# EAGLE design motherboard (EAGLE 9.5.0)
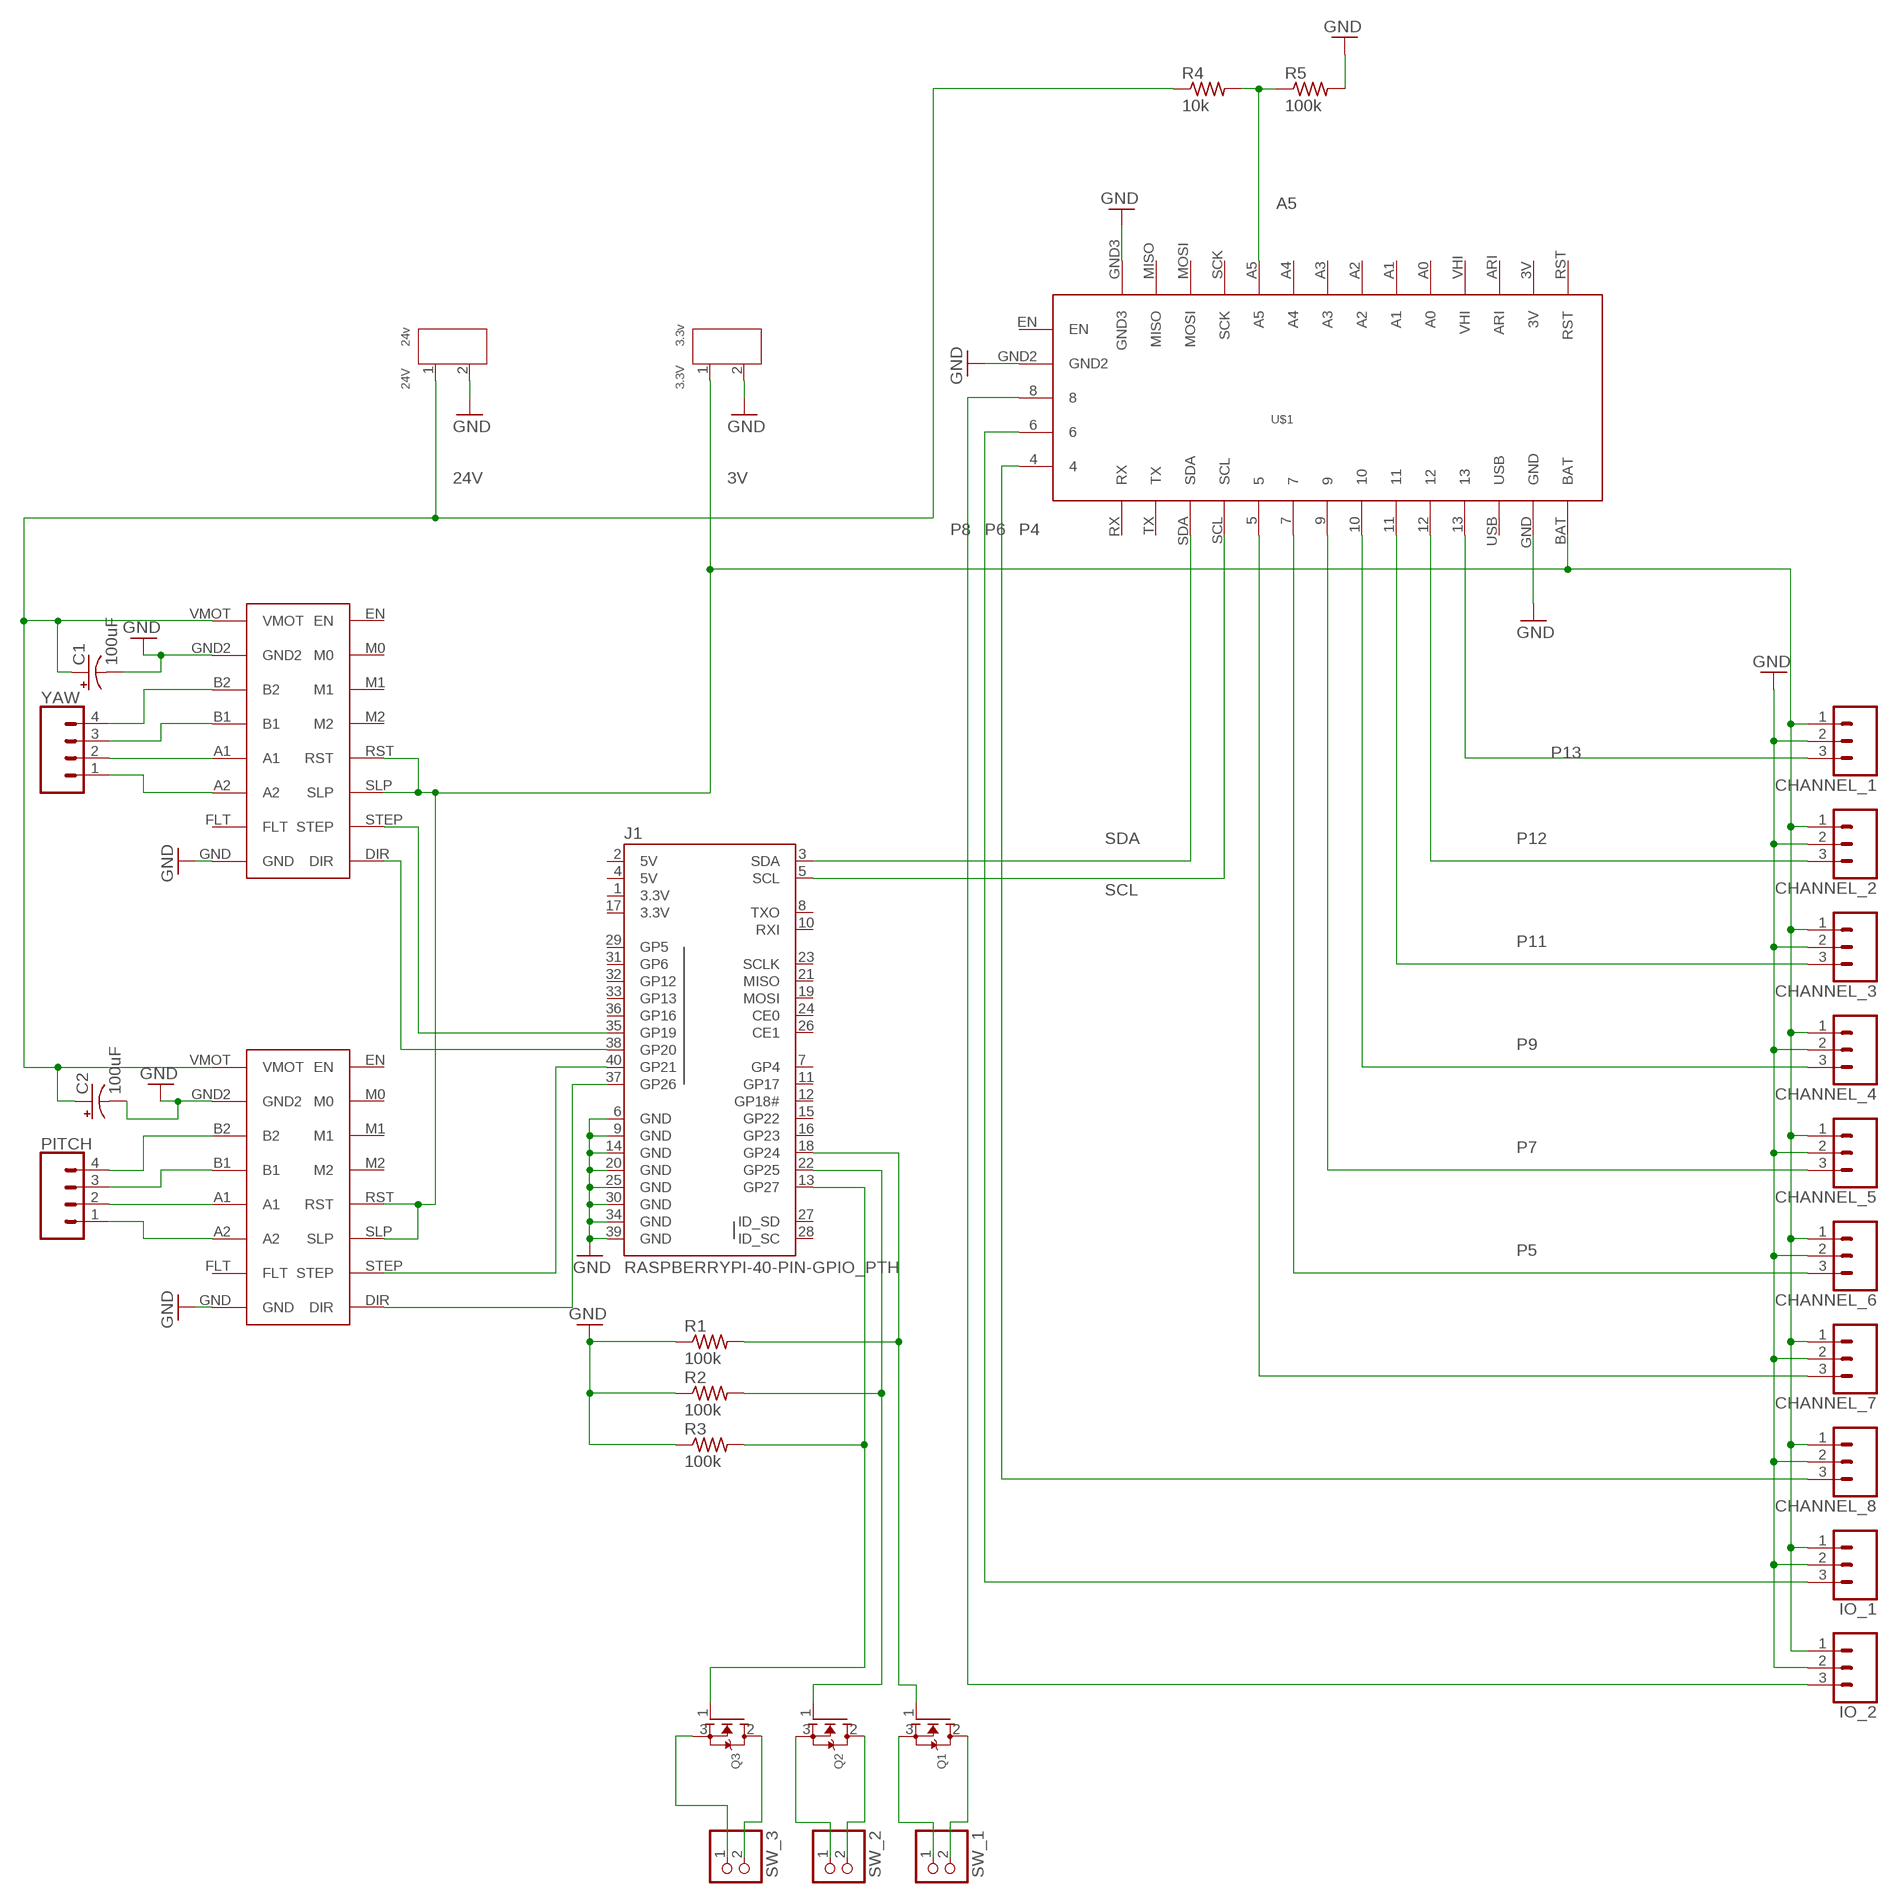
[diagram p0: schematic, sheet 1]

## Parts
3.3V  3.3v  SCREW-TERMINAL-GREEN(2P-5.0)  [H2-5.0-10.5X8.0MM]
24V  24v  SCREW-TERMINAL-GREEN(2P-5.0)  [H2-5.0-10.5X8.0MM]
C1  100uF  1000UF-RADIAL-5MM-25V-20%  [CPOL-RADIAL-5MM-10MM]
C2  100uF  1000UF-RADIAL-5MM-25V-20%  [CPOL-RADIAL-5MM-10MM]
CHANNEL_1  CONN_03JST-PTH  [JST-3-PTH]
CHANNEL_2  CONN_03JST-PTH  [JST-3-PTH]
CHANNEL_3  CONN_03JST-PTH  [JST-3-PTH]
CHANNEL_4  CONN_03JST-PTH  [JST-3-PTH]
CHANNEL_5  CONN_03JST-PTH  [JST-3-PTH]
CHANNEL_6  CONN_03JST-PTH  [JST-3-PTH]
CHANNEL_7  CONN_03JST-PTH  [JST-3-PTH]
CHANNEL_8  CONN_03JST-PTH  [JST-3-PTH]
IO_1  CONN_03JST-PTH  [JST-3-PTH]
IO_2  CONN_03JST-PTH  [JST-3-PTH]
J1  RASPBERRYPI-40-PIN-GPIO_PTH  [2X20_SHROUDED]
PITCH  CONN_04JST-PTH  [JST-4-PTH]
Q1  MOSFET-NGDS_TO220V  [TO220V]
Q2  MOSFET-NGDS_TO220V  [TO220V]
Q3  MOSFET-NGDS_TO220V  [TO220V]
R1  100k  R-US_0207/2V  [0207/2V]
R2  100k  R-US_0207/2V  [0207/2V]
R3  100k  R-US_0207/2V  [0207/2V]
R4  10k  R-US_0207/2V  [0207/2V]
R5  100k  R-US_0207/2V  [0207/2V]
SW_1  JST_2PIN-THM-RA  [JST-PH-2-THM-RA]
SW_2  JST_2PIN-THM-RA  [JST-PH-2-THM-RA]
SW_3  JST_2PIN-THM-RA  [JST-PH-2-THM-RA]
U$1  ITSY_BITSY  [ITSY_BITSY]
U$3  STEPPER_DRIVER  [STEPPER_DRIVER]
U$4  STEPPER_DRIVER  [STEPPER_DRIVER]
YAW  CONN_04JST-PTH  [JST-4-PTH]

## Nets
3V: 3.3V.1 CHANNEL_1.1 CHANNEL_2.1 CHANNEL_3.1 CHANNEL_4.1 CHANNEL_5.1 CHANNEL_6.1 CHANNEL_7.1 CHANNEL_8.1 IO_1.1 IO_2.1 U$1.BAT U$3.RST U$3.SLP U$4.RST U$4.SLP
24V: 24V.1 C1.+ C2.+ R4.1 U$3.VMOT U$4.VMOT
A5: R4.2 R5.1 U$1.A5
GND: 3.3V.2 24V.2 C1.- C2.- CHANNEL_1.2 CHANNEL_2.2 CHANNEL_3.2 CHANNEL_4.2 CHANNEL_5.2 CHANNEL_6.2 CHANNEL_7.2 CHANNEL_8.2 IO_1.2 IO_2.2 J1.6(GND) J1.9(GND) J1.14(GND) J1.20(GND) J1.25(GND) J1.30(GND) J1.34(GND) J1.39(GND) R1.1 R2.1 R3.1 R5.2 U$1.GND U$1.GND2 U$1.GND3 U$3.GND U$3.GND2 U$4.GND2
N$9: CHANNEL_7.3 U$1.5
N$16: J1.13(GP27) Q3.1(G) R3.2
N$17: J1.22(GP25) Q2.1(G) R2.2
N$18: J1.18(GP24) Q1.1(G) R1.2
N$19: J1.37(GP26) U$4.DIR
N$20: Q3.3(S) SW_3.1
N$21: Q3.2(D) SW_3.2
N$22: Q2.3(S) SW_2.1
N$23: Q2.2(D) SW_2.2
N$24: Q1.3(S) SW_1.1
N$25: Q1.2(D) SW_1.2
N$26: J1.40(GP21) U$4.STEP
N$27: J1.38(GP20) U$3.DIR
N$28: J1.35(GP19) U$3.STEP
N$29: U$3.B2 YAW.4
N$30: U$4.GND ; supply symbol labelled GND
N$33: U$3.A2 YAW.1
N$34: U$3.A1 YAW.2
N$35: U$3.B1 YAW.3
N$36: PITCH.4 U$4.B2
N$37: PITCH.3 U$4.B1
N$38: PITCH.2 U$4.A1
N$39: PITCH.1 U$4.A2
P4: CHANNEL_8.3 U$1.4
P5: CHANNEL_6.3 U$1.7
P6: IO_1.3 U$1.6
P7: CHANNEL_5.3 U$1.9
P8: IO_2.3 U$1.8
P9: CHANNEL_4.3 U$1.10
P11: CHANNEL_3.3 U$1.11
P12: CHANNEL_2.3 U$1.12
P13: CHANNEL_1.3 U$1.13
SCL: J1.5(SCL) U$1.SCL
SDA: J1.3(SDA) U$1.SDA
Unconnected: J1.7(GP4) J1.8(TXO) J1.10(RXI) J1.11(GP17) J1.12(GP18#) J1.15(GP22) J1.16(GP23) J1.19(MOSI) J1.21(MISO) J1.23(SCLK) J1.24(CE0) J1.26(CE1) J1.27(ID_SD) J1.28(ID_SC) J1.29(GP5) J1.31(GP6) J1.32(GP12) J1.33(GP13) J1.36(GP16) U$1.3V U$1.A0 U$1.A1 U$1.A2 U$1.A3 U$1.A4 U$1.ARI U$1.EN U$1.MISO U$1.MOSI U$1.RST U$1.RX U$1.SCK U$1.TX U$1.USB U$1.VHI U$3.EN U$3.FLT U$3.M0 U$3.M1 U$3.M2 U$4.EN U$4.FLT U$4.M0 U$4.M1 U$4.M2

## Power pins joined to a net without a drawn wire
3.3V: J1.1(3.3V) J1.17(3.3V)
5V: J1.2(5V) J1.4(5V)

## Library data of the parts
3.3V 24V = OPL_Connector:SCREW-TERMINAL-GREEN(2P-5.0): 320110031; VALUE: GREEN-2P-5.0
C1 C2 = SparkFun-Capacitors:1000UF: 1,000µF/1mF ceramic capacitors A capacitor is a passive two-terminal electrical component used to store electrical energy temporarily in an electric field. CAP-08070; PROD_ID: CAP-09538; VALUE: 1mF
CHANNEL_1-CHANNEL_8 IO_1 IO_2 = SparkFun-Connectors:CONN_03: Multi connection point. Often used as Generic Header-pin footprint for 0.1 inch spaced/style header connections On any of the 0.1 inch spaced packages, you can populate with these: Break Away Headers - Straight <https://www.sparkfun.com/products/116> (PRT-00116) Break Away Male Headers - Right Angle <https://www.sparkfun.com/products/553> (PRT-00553) Female Headers <https://www.sparkfun.com/products/115> (PRT-00115) Break Away Headers - Machine Pin <https://www.sparkfun.com/products/117> (PRT-00117) Break Away Female Headers - Swiss Machine Pin <https://www.sparkfun.com/products/743> (PRT-00743) Stackable Header - 3 Pin (Female, 0.1") <https://www.sparkfun.com/products/13875> (PRT-13875) For SCREWTERMINALS and SPRING TERMINALS visit here: Screw Terimnals on SparkFun.com <https://www.sparkfun.com/search/results?term=Screw+Terminals> (5mm/3.5mm/2.54mm spacing) This device is also useful as a general connection point to wire up your design to another part of your project. Our various solder wires solder well into these plated through hole pads. Hook-Up Wire - Assortment (Stranded, 22 AWG) <https://www.sparkfun.com/products/11375> (PRT-11375) Hook-Up Wire - Assortment (Solid Core, 22 AWG) <https://www.sparkfun.com/products/11367> (PRT-11367) View the entire wire category on our website here <https://www.sparkfun.com/categories/141> Special notes: Molex polarized connector foot print use with SKU : PRT-08232 with associated crimp pins and housings.; PROD_ID: WIRE-10037; SF_ID: PRT-09915
J1 = SparkFun-Connectors:RASPBERRYPI-40-PIN-GPIO: Raspberry Pi GPIO Header 2x20 pin connector, as found on B, B+, A+ models. Both shrouded PTH and SMT versions available. SparkFun Products: GPIO Shrouded Header <https://www.sparkfun.com/products/13054>- PTH SparkFun Pi Wedge (Preassembled) <https://www.sparkfun.com/products/13717>; PROD_ID: CONN-12263; SF_ID: PRT-13054
PITCH YAW = SparkFun-Connectors:CONN_04: Multi connection point. Often used as Generic Header-pin footprint for 0.1 inch spaced/style header connections On any of the 0.1 inch spaced packages, you can populate with these: Break Away Headers - Straight <https://www.sparkfun.com/products/116> (PRT-00116) Break Away Male Headers - Right Angle <https://www.sparkfun.com/products/553> (PRT-00553) Female Headers <https://www.sparkfun.com/products/115> (PRT-00115) Break Away Headers - Machine Pin <https://www.sparkfun.com/products/117> (PRT-00117) Break Away Female Headers - Swiss Machine Pin <https://www.sparkfun.com/products/743> (PRT-00743) For SCREWTERMINALS and SPRING TERMINALS visit here: Screw Terimnals on SparkFun.com <https://www.sparkfun.com/search/results?term=Screw+Terminals> (5mm/3.5mm/2.54mm spacing) This device is also useful as a general connection point to wire up your design to another part of your project. Our various solder wires solder well into these plated through hole pads. Hook-Up Wire - Assortment (Stranded, 22 AWG) <https://www.sparkfun.com/products/11375> (PRT-11375) Hook-Up Wire - Assortment (Solid Core, 22 AWG) <https://www.sparkfun.com/products/11367> (PRT-11367) View the entire wire category on our website here <https://www.sparkfun.com/categories/141> Special notes: Molex polarized connector foot print use with SKU : PRT-08231 with associated crimp pins and housings. 1MM SMD Version SKU: PRT-10208; PROD_ID: WIRE-13531; SF_ID: PRT-09916
Q1-Q3 = adafruit:MOSFET-N: N-Channel Mosfet 2N7002E - 60V 260mA SOT23 [Digikey: 2N7002ET1GOSTR-ND] - REEL BSH103 - 30V 850mA SOT23 [Digikey: 568-5013-1-ND]
R1-R5 = adafruit:R-US_: RESISTOR, American symbol
SW_1-SW_3 = adafruit:JST_2PIN: JST 2-Pin Connectors of various flavors SMT-RA (S2B-PH-SM4) 4UConnector #17311 SMT (B2B-PH-SM4) THM-RA (S2B-PH) THM (B2B-PH)
U$1 = Julie_Iaccarino:ITSY_BITSY
U$3 U$4 = Julie_Iaccarino:STEPPER_DRIVER

## Board
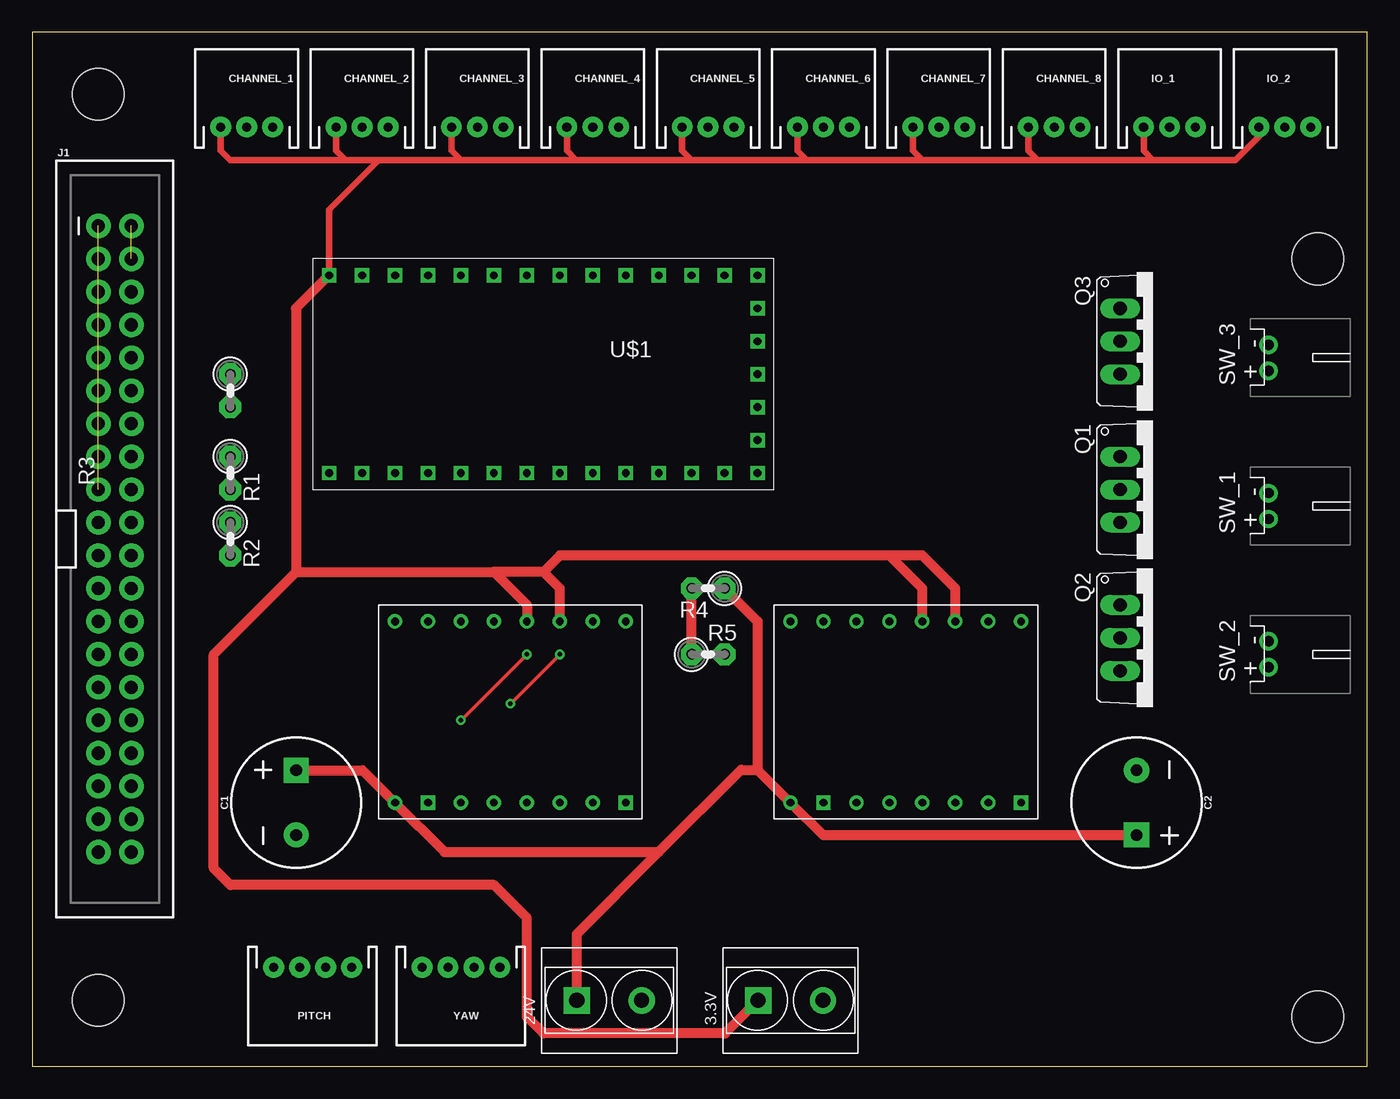
[diagram p1: board, top side]
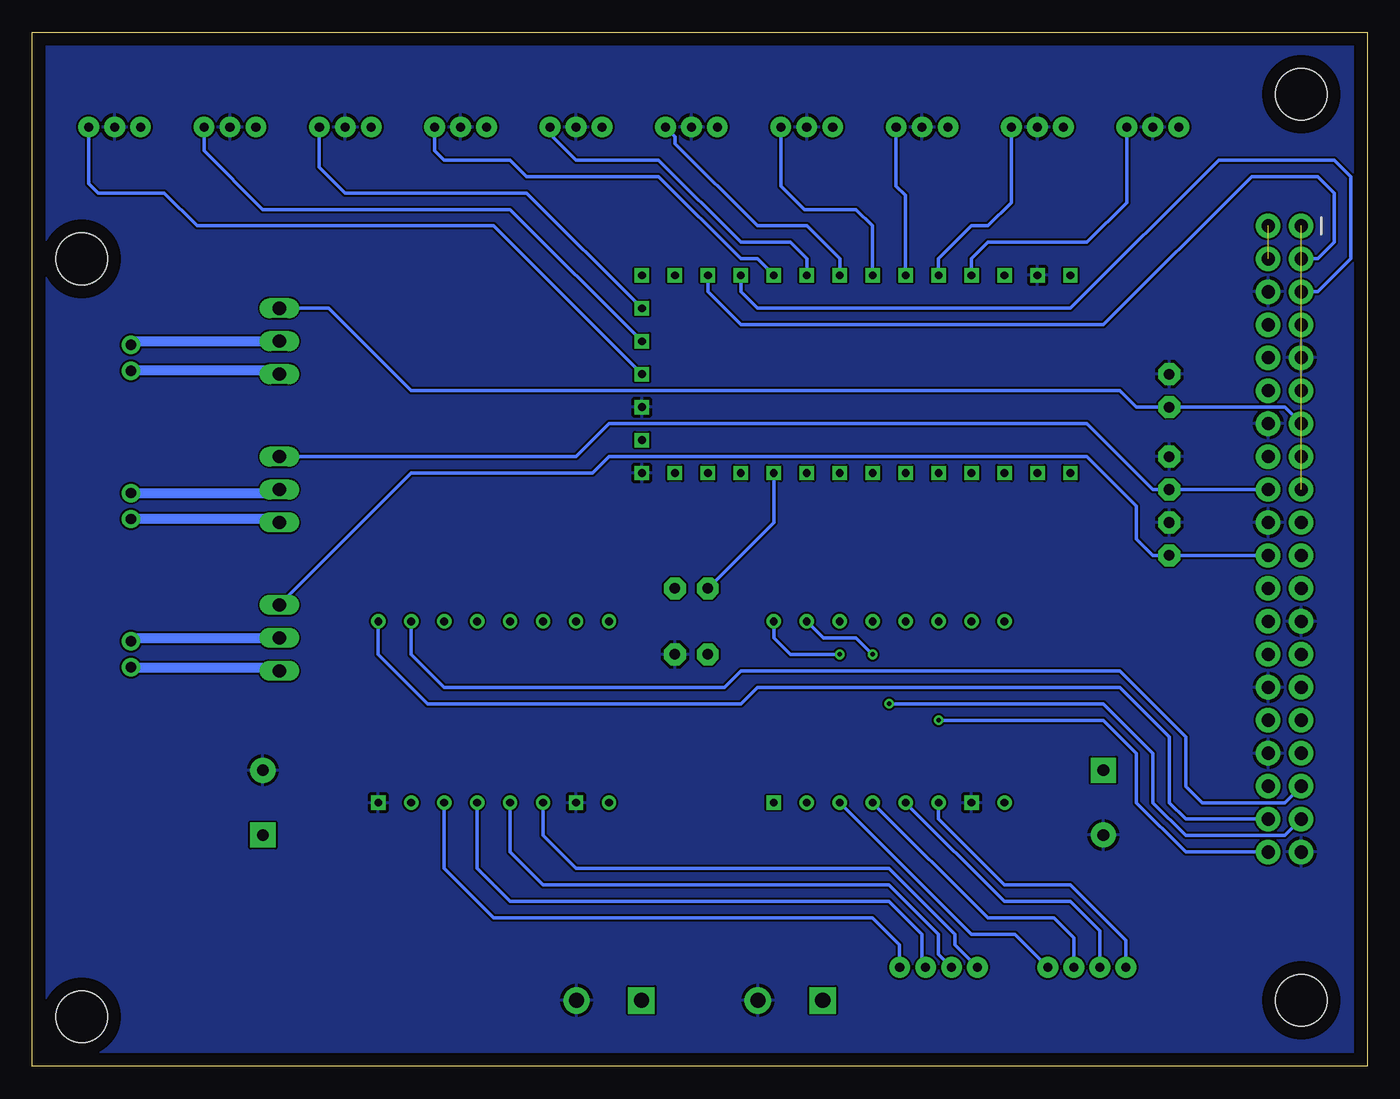
[diagram p2: board, bottom side, seen from below]

Size 102.85 x 79.68 mm. Coordinates in mm from the lower left corner, seen from the top.
Outline: 0,0 102.85,0 102.85,79.68 0,79.68 0,0
Copper layers (1*16): Top 0.035mm / dielectric 1.5mm / Bottom 0.035mm
Design rules "default": minimum track width 6mil, minimum drill 0.35mm, track to track 6mil, track to pad 6mil, pad to pad 6mil, via to via 6mil, smd to smd 6mil, copper to edge 40mil, drill to drill 6mil, minimum pad ring 10mil, minimum via ring 8mil, stop-mask expansion 4mil, vias tented up to drill 0mil, thermal gap 10mil
Holes 3.99 mm at 5.08,74.93 5.08,5.08 99.06,3.81 99.06,62.23

### Footprints (pad centres in the part's own frame; a part is rotated, then mirrored left to right if it is on the bottom)
H2-5.0-10.5X8.0MM = drill 1.168 pad 2.032 square: 1 0,2.5 | drill 1.168 pad 2.032: 2 0,-2.5
CPOL-RADIAL-5MM-10MM = drill 0.9 pad 1.93 square: + 2.5,0 | drill 0.9 pad 1.93: - -2.5,0
JST-3-PTH = drill 0.7 pad 1.6: 1 -2,0; 2 0,0; 3 2,0
2X20_SHROUDED = drill 1.016 pad 1.88: 1 -1.27,24.13; 2 1.27,24.13; 3 -1.27,21.59; 4 1.27,21.59; 5 -1.27,19.05; 6 1.27,19.05; 7 -1.27,16.51; 8 1.27,16.51; 9 -1.27,13.97; 10 1.27,13.97; 11 -1.27,11.43; 12 1.27,11.43; 13 -1.27,8.89; 14 1.27,8.89; 15 -1.27,6.35; 16 1.27,6.35; 17 -1.27,3.81; 18 1.27,3.81; 19 -1.27,1.27; 20 1.27,1.27; 21 -1.27,-1.27; 22 1.27,-1.27; 23 -1.27,-3.81; 24 1.27,-3.81; 25 -1.27,-6.35; 26 1.27,-6.35; 27 -1.27,-8.89; 28 1.27,-8.89; 29 -1.27,-11.43; 30 1.27,-11.43; 31 -1.27,-13.97; 32 1.27,-13.97; 33 -1.27,-16.51; 34 1.27,-16.51; 35 -1.27,-19.05; 36 1.27,-19.05; 37 -1.27,-21.59; 38 1.27,-21.59; 39 -1.27,-24.13; 40 1.27,-24.13
JST-4-PTH = drill 0.7 pad 1.6: 1 -3,0; 2 -1,0; 3 1,0; 4 3,0
TO220V = drill 1.016 long: 1 -2.54,-2.54; 2 0,-2.54; 3 2.54,-2.54
0207/2V = drill 0.813 pad 1.676 octagon: 1 -1.27,0; 2 1.27,0
JST-PH-2-THM-RA = drill 0.8 pad 1.422: 1 1,0; 2 -1,0
ITSY_BITSY = drill 0.6 square: 3V -21.59,-11.43; 4 8.89,1.27; 5 -1.27,3.81; 6 8.89,-1.27; 7 -3.81,3.81; 8 8.89,-3.81; 9 -6.35,3.81; 10 -8.89,3.81; 11 -11.43,3.81; 12 -13.97,3.81; 13 -16.51,3.81; A0 -13.97,-11.43; A1 -11.43,-11.43; A2 -8.89,-11.43; A3 -6.35,-11.43; A4 -3.81,-11.43; A5 -1.27,-11.43; ARI -19.05,-11.43; BAT -24.13,3.81; EN 8.89,-8.89; GND -21.59,3.81; GND2 8.89,-11.43; GND3 8.89,-6.35; MISO 6.35,-11.43; MOSI 3.81,-11.43; RST -24.13,-11.43; RX 8.89,3.81; SCK 1.27,-11.43; SCL 1.27,3.81; SDA 3.81,3.81; TX 6.35,3.81; USB -19.05,3.81; VHI -16.51,-11.43
STEPPER_DRIVER = drill 0.6: A1 -5.08,3.81; A2 -7.62,3.81; B1 -2.54,3.81; B2 0,3.81; DIR -12.7,-10.16; EN 5.08,-10.16; FLT -10.16,3.81; M0 2.54,-10.16; M1 0,-10.16; M2 -2.54,-10.16; RST -5.08,-10.16; SLP -7.62,-10.16; STEP -10.16,-10.16; VMOT 5.08,3.81 | drill 0.6 square: GND -12.7,3.81; GND2 2.54,3.81

### Placement (x,y rotation side)
3.3V  58.42,5.08 90 top
24V  44.45,5.08 90 top
C1  20.32,20.32 90 top
C2  85.09,20.32 270 top
CHANNEL_1  16.51,72.39 0 top
CHANNEL_2  25.4,72.39 0 top
CHANNEL_3  34.29,72.39 0 top
CHANNEL_4  43.18,72.39 0 top
CHANNEL_5  52.07,72.39 0 top
CHANNEL_6  60.96,72.39 0 top
CHANNEL_7  69.85,72.39 0 top
CHANNEL_8  78.74,72.39 0 top
IO_1  87.63,72.39 0 top
IO_2  96.52,72.39 0 top
J1  6.35,40.64 0 top
PITCH  21.59,7.62 180 top
Q1  86.36,44.45 270 top
Q2  86.36,33.02 270 top
Q3  86.36,55.88 270 top
R1  15.24,45.72 270 top
R2  15.24,40.64 270 top
R3  15.24,52.07 270 top
R4  52.07,36.83 180 top
R5  52.07,31.75 0 top
SW_1  95.25,43.18 270 top
SW_2  95.25,31.75 270 top
SW_3  95.25,54.61 270 top
U$1  46.99,57.15 0 top
U$3  63.5,24.13 180 top
U$4  33.02,24.13 180 top
YAW  33.02,7.62 180 top

### Tracks (layer width: path | path; a pad name or v marks a point on that pad's centre or on a via)
3.3V  (1 unrouted)
3V
  Top 0.508: CHANNEL_1.1 14.51,70.58 15.24,69.85 24.13,69.85 | 24.13,69.85 26.67,69.85 | 26.67,69.85 33.02,69.85 | 33.02,69.85 41.91,69.85 | 41.91,69.85 50.8,69.85 | 50.8,69.85 59.69,69.85 | 68.58,69.85 77.47,69.85 | 77.47,69.85 86.36,69.85 | 86.36,69.85 92.71,69.85 94.52,71.66 IO_2.1 | IO_1.1 85.63,70.58 86.36,69.85 | CHANNEL_8.1 76.74,70.58 77.47,69.85 | CHANNEL_7.1 67.85,70.58 68.58,69.85 | CHANNEL_6.1 58.96,70.58 59.69,69.85 | CHANNEL_5.1 50.07,70.58 50.8,69.85 | CHANNEL_4.1 41.18,70.58 41.91,69.85 | CHANNEL_3.1 32.29,70.58 33.02,69.85 | CHANNEL_2.1 23.4,70.58 24.13,69.85 | 59.69,69.85 68.58,69.85 | U$1.BAT 22.86,66.04 26.67,69.85
  Top 0.762: 3.3V.1 53.38,2.54 39.37,2.54 38.1,3.81 38.1,11.43 35.56,13.97 15.24,13.97 13.97,15.24 13.97,31.75 20.32,38.1 | 20.32,38.1 35.56,38.1 | 35.56,38.1 38.1,35.56 U$4.RST | U$4.SLP 40.64,36.83 39.37,38.1 | 39.37,38.1 35.56,38.1 | U$1.BAT 20.32,58.42 20.32,38.1 | U$3.SLP 71.12,36.83 68.58,39.37 66.04,39.37 | 39.37,38.1 40.64,39.37 66.04,39.37 | U$3.RST 68.58,36.83 66.04,39.37
5V  (1 unrouted)
24V
  Top 0.762: R4.1 55.88,34.29 55.88,22.86 | 55.88,22.86 U$3.VMOT 60.92,17.82 C2.+ | 24V.1 41.95,10.2 48.26,16.51 | 55.88,22.86 54.61,22.86 48.26,16.51 | C1.+ 25.44,22.82 U$4.VMOT 31.75,16.51 48.26,16.51
A5
  Top 0.762: R5.1 R4.2
  Bottom 0.254: R4.2 45.72,41.91 U$1.A5
GND
  pour Bottom: 0,80.01 102.87,80.01 102.87,0 0,0
N$9
  Bottom 0.254: CHANNEL_7.3 71.85,70.58 71.12,69.85 66.04,69.85 64.77,68.58 54.61,68.58 48.26,62.23 46.99,62.23 U$1.5
N$16
  Bottom 0.254: J1.13 6.35,50.8 R3.2 17.78,50.8 19.05,52.07 73.66,52.07 80.01,58.42 Q3.1
N$17
  Bottom 0.254: J1.22 R2.2 16.51,39.37 17.78,40.64 17.78,43.18 21.59,46.99 58.42,46.99 59.69,45.72 73.66,45.72 Q2.1
N$18
  Bottom 0.254: J1.18 R1.2 16.51,44.45 21.59,49.53 58.42,49.53 60.96,46.99 Q1.1
N$19  (via drill 0.35)
  Top 0.254: v36.83,27.94 v40.64,31.75
  Bottom 0.254: J1.37 6.35,17.78 13.97,17.78 16.51,20.32 16.51,24.13 20.32,27.94 v36.83,27.94 | v40.64,31.75 44.45,31.75 45.72,33.02 U$4.DIR
N$20
  Bottom 0.762: Q3.3 84.09,53.61 SW_3.1
N$21
  Bottom 0.762: SW_3.2 94.98,55.88 Q3.2
N$22
  Bottom 0.762: SW_2.1 83.82,30.75 Q2.3
N$23
  Bottom 0.762: SW_2.2 94.98,33.02 Q2.2
N$24
  Bottom 0.762: Q1.3 84.09,42.18 SW_1.1
N$25
  Bottom 0.762: SW_1.2 84.09,44.18 Q1.2
N$26  (via drill 0.35)
  Top 0.254: v33.02,26.67 v38.1,31.75
  Bottom 0.254: J1.40 13.97,16.51 17.78,20.32 17.78,24.13 20.32,26.67 v33.02,26.67 | v38.1,31.75 39.37,33.02 41.91,33.02 U$4.STEP
N$27
  Bottom 0.254: J1.38 13.97,19.05 15.24,20.32 15.24,25.4 19.05,29.21 46.99,29.21 48.26,27.94 72.39,27.94 76.2,31.75 U$3.DIR
N$28
  Bottom 0.254: J1.35 6.35,20.32 12.7,20.32 13.97,21.59 13.97,25.4 19.05,30.48 48.26,30.48 49.53,29.21 71.12,29.21 73.66,31.75 U$3.STEP
N$29
  Bottom 0.254: YAW.4 31.75,9.35 31.75,10.16 36.83,15.24 60.96,15.24 63.5,17.78 U$3.B2
N$33
  Bottom 0.254: YAW.1 36.02,9.35 38.1,11.43 67.31,11.43 71.12,15.24 U$3.A2
N$34
  Bottom 0.254: YAW.2 34.29,7.89 34.29,10.16 36.83,12.7 66.04,12.7 68.58,15.24 U$3.A1
N$35
  Bottom 0.254: YAW.3 33.02,8.62 33.02,10.16 36.83,13.97 63.5,13.97 66.04,16.51 U$3.B1
N$36
  Bottom 0.254: PITCH.4 18.59,9.7 22.86,13.97 27.94,13.97 33.02,19.05 U$4.B2
N$37
  Bottom 0.254: PITCH.3 20.59,10.43 22.86,12.7 27.94,12.7 U$4.B1
N$38
  Bottom 0.254: PITCH.2 22.59,9.89 24.13,11.43 29.21,11.43 U$4.A1
N$39
  Bottom 0.254: PITCH.1 27.13,10.16 30.48,10.16 U$4.A2
P4
  Bottom 0.254: CHANNEL_8.3 80.74,69.31 78.74,67.31 64.77,67.31 U$1.4
P5
  Bottom 0.254: U$1.7 43.18,62.23 44.45,63.5 48.26,63.5 54.61,69.85 60.96,69.85 62.96,71.85 CHANNEL_6.3
P6
  Bottom 0.254: IO_1.3 89.63,70.58 85.09,66.04 66.04,66.04 U$1.6
P7
  Bottom 0.254: CHANNEL_5.3 53.34,71.66 53.34,71.12 46.99,64.77 43.18,64.77 40.64,62.23 U$1.9
P8
  Bottom 0.254: IO_2.3 98.52,68.04 97.79,67.31 92.71,67.31 90.17,64.77 67.31,64.77 U$1.8
P9
  Bottom 0.254: CHANNEL_4.3 45.18,67.85 43.37,66.04 39.37,66.04 38.1,64.77 U$1.10
P11
  Bottom 0.254: CHANNEL_3.3 36.29,67.85 35.56,67.12 U$1.11
P12
  Bottom 0.254: CHANNEL_2.3 27.4,66.58 29.21,64.77 30.48,64.77 33.02,62.23 U$1.12
P13
  Bottom 0.254: CHANNEL_1.3 18.51,66.58 21.59,63.5 29.21,63.5 30.48,62.23 U$1.13
SCL
  Bottom 0.254: J1.5 3.81,59.69 1.27,62.23 1.27,68.58 2.54,69.85 11.43,69.85 22.86,58.42 46.99,58.42 48.26,59.69 U$1.SCL
SDA
  Bottom 0.254: J1.3 3.81,62.23 2.54,63.5 2.54,67.31 3.81,68.58 8.89,68.58 20.32,57.15 48.26,57.15 50.8,59.69 U$1.SDA